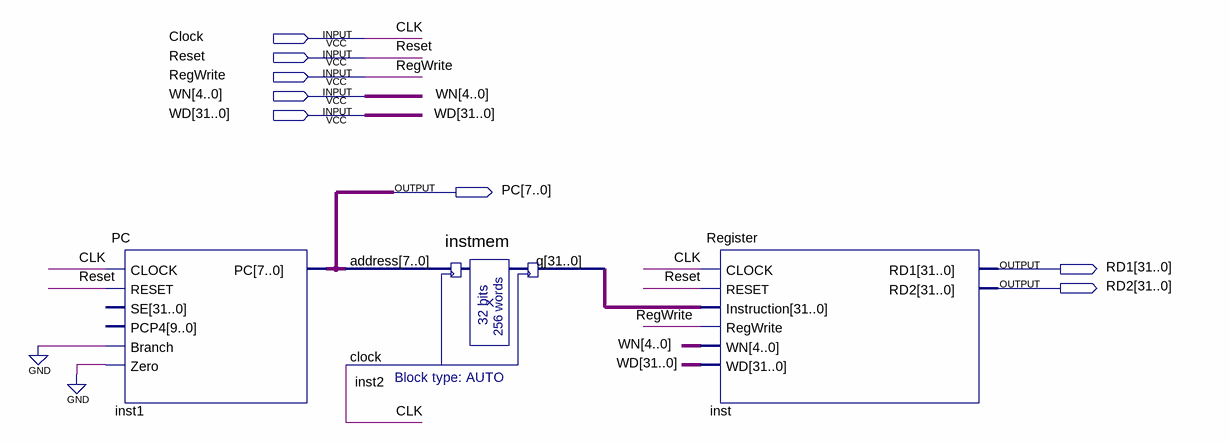
[diagram p0: schematic sheet]
// Quartus schematic TESTER.bdf as structural Verilog: 3 symbols, 8 pins
module TESTER (
  input  Clock,
  input  Reset,
  input  RegWrite,
  input  [4:0] WN,
  input  [31:0] WD,
  output [7:0] PC,
  output [31:0] RD1,
  output [31:0] RD2
);

  wire [31:0] inst2_q;

  PC inst1 (.CLOCK(Clock), .RESET(Reset), .Branch(1'b0), .Zero(1'b0), .PC(PC));  // open: SE, PCP4
  instmem inst2 (.address(PC), .clock(Clock), .q(inst2_q));
  Register inst (
    .CLOCK(Clock), .RESET(Reset), .Instruction(inst2_q), .RegWrite(RegWrite), .WN(WN), .WD(WD), .RD1(RD1),
    .RD2(RD2));

  // Other names for the same wires on the sheet: CLK = Clock
endmodule
